# Altium schematic sheet MotherBoard.SchDoc: MFC Mother Board
size B; Address1: aaa; Revision: V0.1
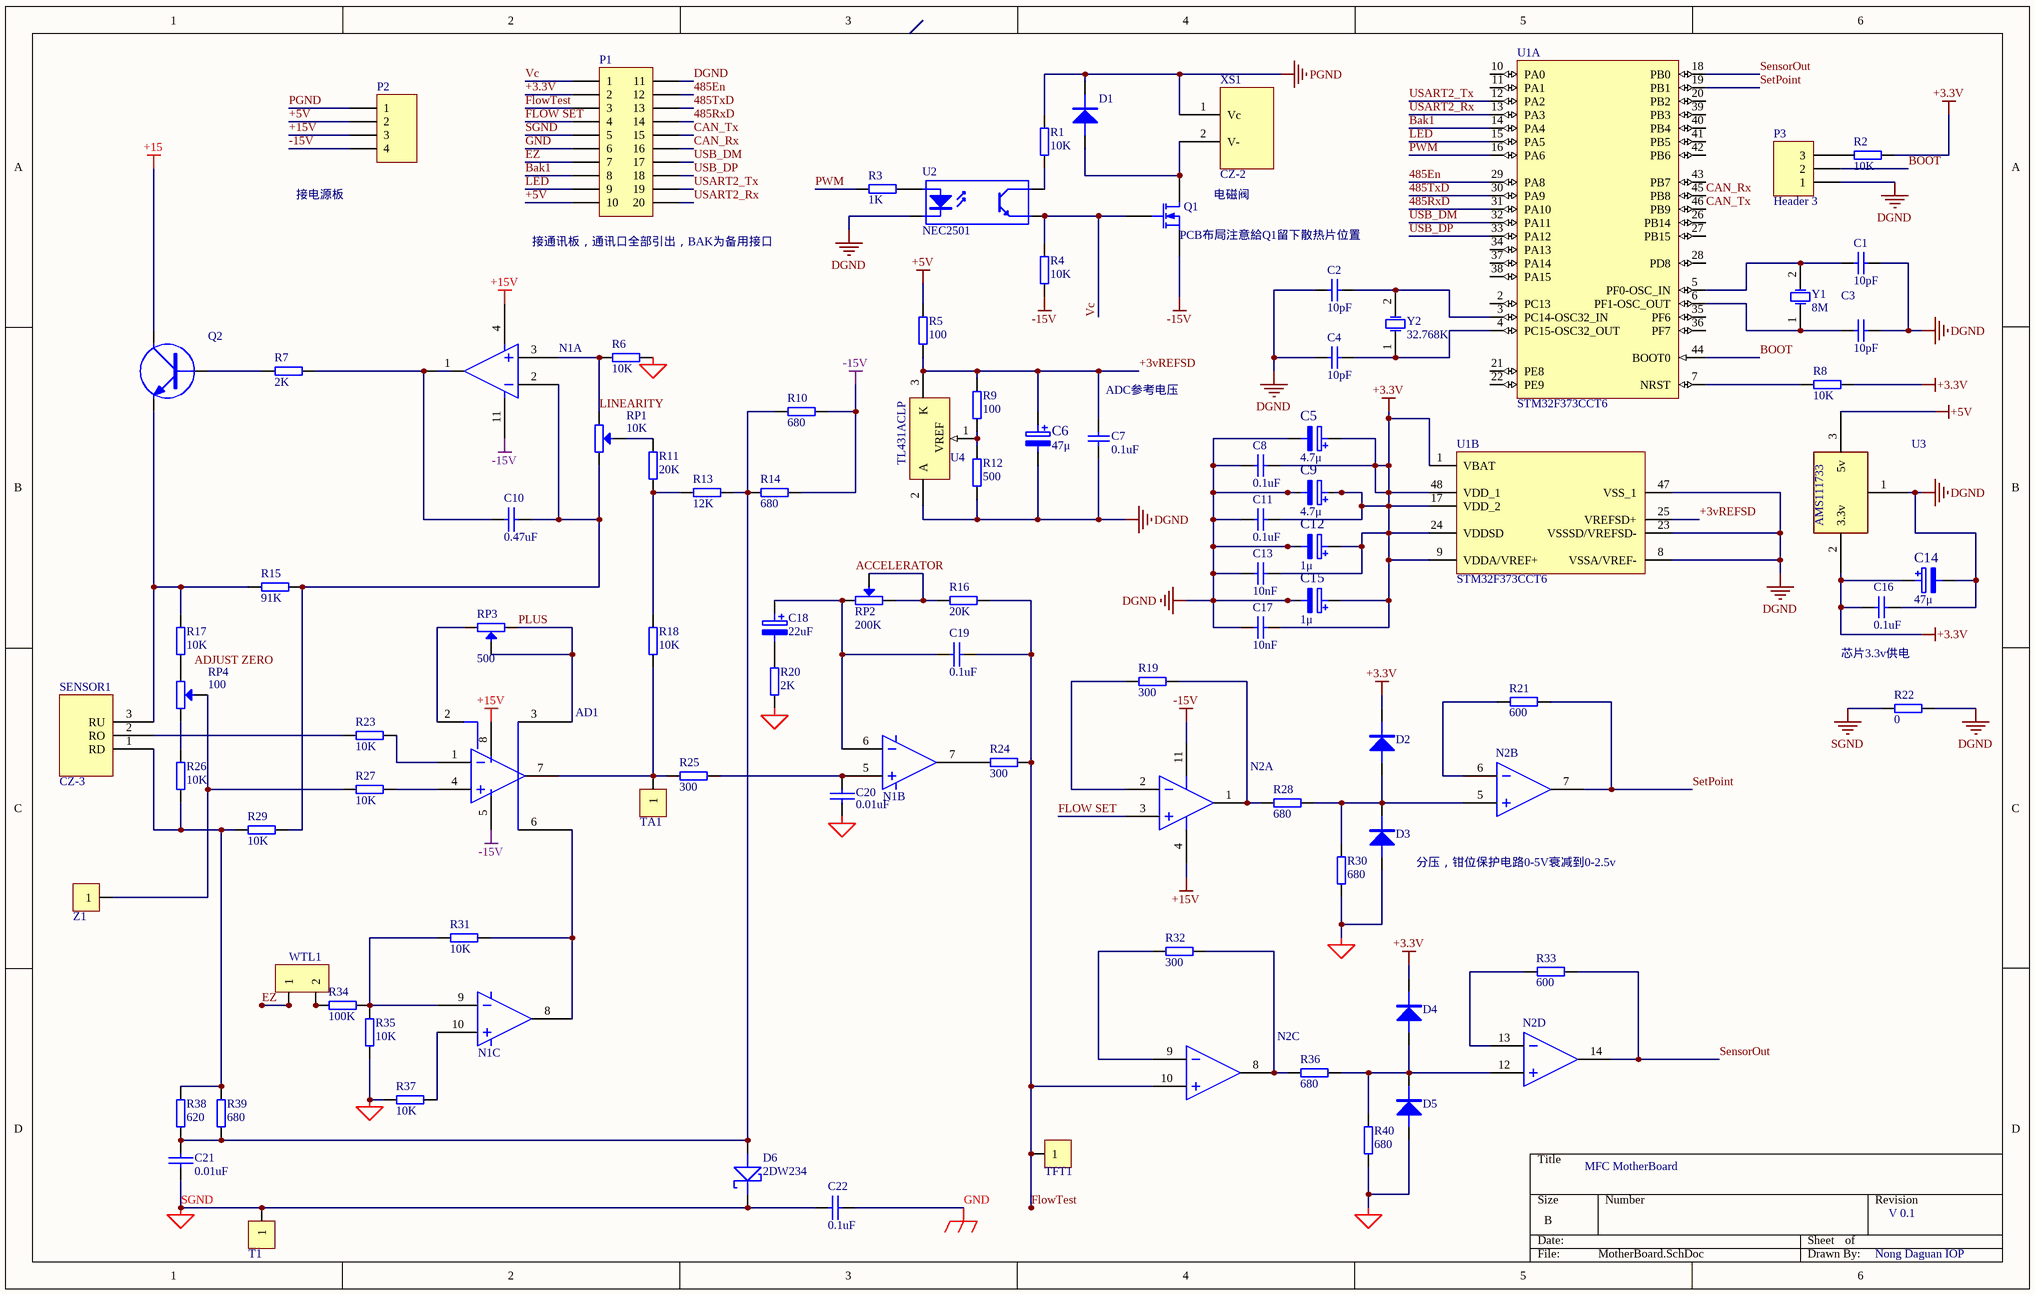
[diagram p0: MotherBoard.SchDoc]

## Parts
AD1  (no value)  [SO-8]
C1  10pF  [R.4]
C2  10pF  [R.4]
C3  10pF  [R.4]
C4  10pF  [R.4]
C5  4.7μ  [CA-22U]
C6  47μ  [CA-22U]
C7  0.1uF  [R.4]
C8  0.1uF  [R.4]
C9  4.7μ  [CA-22U]
C10  0.47uF  [R.4]
C11  0.1uF  [R.4]
C12  1μ  [CA-22U]
C13  10nF  [R.4]
C14  47μ  [CA-22U]
C15  1μ  [CA-22U]
C16  0.1uF  [R.4]
C17  10nF  [R.4]
C18  22uF  [CA-22U]
C19  0.1uF  [R.4]
C20  0.01uF  [R.4]
C21  0.01uF  [R.4]
C22  0.1uF  [R.4]
D1  2CK73C  [V.4]  (value not drawn)
D2  2CK73C  [DIODE]  (value not drawn)
D3  2CK73C  [DIODE]  (value not drawn)
D4  2CK73C  [DIODE]  (value not drawn)
D5  2CK73C  [DIODE]  (value not drawn)
D6  2DW234  [zena]
N1  LM124  [SO-14]  (value not drawn)  (parts A,B,C of 4)
N2  LM124  [SO-14]  (value not drawn)  (parts A,B,C,D of 4)
P1  (no value)  [HDR2X10_CEN]
P2  (no value)  [HDR1X4]
P3  Header 3  [HDR1X3]
Q1  MOSFET-N  [TO-220AB]  (value not drawn)
Q2  MC9013  [BJT]  (value not drawn)
R1  10K  [R.4]
R2  10K  [R.4]
R3  1K  [R.4]
R4  10K  [R.4]
R5  100  [R.4]
R6  10K  [R.4]
R7  2K  [R.4]
R8  10K  [R.4]
R9  100  [RAD0.1]
R10  680  [R.4]
R11  20K  [R.4]
R12  500  [RAD0.1]
R13  12K  [R.4]
R14  680  [R.4]
R15  91K  [R.4]
R16  20K  [R.4]
R17  10K  [RAD0.1]
R18  10K  [R.4]
R19  300  [R.4]
R20  2K  [R.4]
R21  600  [R.4]
R22  0  [R.4]
R23  10K  [R.4]
R24  300  [R.4]
R25  300  [R.4]
R26  10K  [RAD0.1]
R27  10K  [R.4]
R28  680  [RAD0.1]
R29  10K  [R.4]
R30  680  [RAD0.1]
R31  10K  [R.4]
R32  300  [R.4]
R33  600  [R.4]
R34  100K  [R.4]
R35  10K  [R.4]
R36  680  [RAD0.1]
R37  10K  [R.4]
R38  620  [RAD0.1]
R39  680  [RAD0.1]
R40  680  [RAD0.1]
RP1  10K  [VR5132]
RP2  200K  [changable res]
RP3  500  [VR5132]
RP4  100  [VR5132]
SENSOR1  CZ-3  [SENSOR]
T1  CON1  [PAD - RECT]  (value not drawn)
TA1  CON1  [PAD - RECT]  (value not drawn)
TFT1  CON1  [PAD - RECT]  (value not drawn)
U1  STM32F373CCT6  [STM-LQFP48_N]  (parts A,B of 2)
U2  NEC2501  [DIP-4]
U3  AMS111733  [SOT223_N]
U4  TL431ACLP  [LP03]
WTL1  CON1  [ADJ]  (value not drawn)
XS1  CZ-2  [VALVE]
Y1  8M  [XTAL1]
Y2  32.768K  [XTAL1]
Z1  CON1  [PAD - RECT]  (value not drawn)

## Nets
+3.3V: C5.1 C8.2 C9.1 C11.2 C12.1 C13.2 C14.1 C15.1 C16.1 C17.2 D2.K D4.K P1.2 R2.2 R8.2 U1.1(VBAT) U1.9(VDDA/VREF+) U1.17(VDD_2) U1.24(VDDSD) U1.48(VDD_1) U3.2(3.3v)
+5V: P1.10 P2.2 R5.2 U3.3(5v)
+15: Q2.C
+15V: AD1.8 N1.4 N2.4(V+) P2.3
-15V: AD1.5 N1.11 N2.11(GND) P2.4 Q1.3(S) R4.1 R10.2 R14.2
DGND: C1.2 C2.1 C3.2 C4.1 C5.2 C6.2 C7.1 C8.1 C9.2 C11.1 C12.2 C13.1 C14.2 C15.2 C16.2 C17.1 P1.11 P3.1 R12.1 R22.2 U1.8(VSSA/VREF-) U1.23(VSSSD/VREFSD-) U1.47(VSS_1) U2.2(K) U3.1(GND) U4.2(A)
GND: C22.2 P1.6
PGND: D1.K P2.1 R1.2 XS1.1(Vc)
SGND: C20.1 C21.2 C22.1 D3.A D5.A D6.K(CATHODE) P1.5 R6.2 R20.1 R22.1 R30.1 R35.1 R37.2 R40.1 T1.1
485En: P1.12 U1.29(PA8)
485RxD: P1.14 U1.31(PA10)
485TxD: P1.13 U1.30(PA9)
+3vREFSD: C6.1 C7.2 R5.1 R9.1 U1.25(VREFSD+) U4.3(K)
Bak1: P1.8 U1.14(PA4)
BOOT: P3.2 U1.44(BOOT0)
CAN_Rx: P1.16 U1.45(PB8)
CAN_Tx: P1.15 U1.46(PB9)
EZ: P1.7 WTL1.1
FLOW SET: N2.3(INPUT1+) P1.4
FlowTest: C19.2 N2.10(INPUT3+) P1.3 R16.2 R24.2 TFT1.1
LED: P1.9 U1.15(PA5)
PWM: R3.1 U1.16(PA6)
SensorOut: N2.14(OUTPUT4) R33.2 U1.18(PB0)
SetPoint: N2.7(OUTPUT2) R21.2 U1.19(PB1)
USART2_Rx: P1.20 U1.13(PA3)
USART2_Tx: P1.19 U1.12(PA2)
USB_DM: P1.17 U1.32(PA11)
USB_DP: P1.18 U1.33(PA12)
Vc: P1.1 Q1.1(G) R4.2 U2.3(E)
NetAD1_1: AD1.1 R23.2
NetAD1_2: AD1.2 RP3.2
NetAD1_3: AD1.3 RP3.1 RP3.3
NetAD1_4: AD1.4 R27.2
NetAD1_6: AD1.6 N1.8 R31.2
NetAD1_7: AD1.7 R18.1 R25.1 TA1.1
NetC1_1: C1.1 U1.5(PF0-OSC_IN) Y1.2(OSC2)
NetC2_2: C2.2 U1.3(PC14-OSC32_IN) Y2.2(OSC2)
NetC3_1: C3.1 U1.6(PF1-OSC_OUT) Y1.1(OSC1)
NetC4_2: C4.2 U1.4(PC15-OSC32_OUT) Y2.1(OSC1)
NetC10_1: C10.1 N1.1 R7.2
NetC10_2: C10.2 N1.2 R15.2 R29.2 RP1.2
NetC18_1: C18.1 C19.1 N1.6 RP2.1
NetC18_2: C18.2 R20.2
NetC20_2: C20.2 N1.5 R25.2
NetC21_1: C21.1 D6.A(ANODE) R10.1 R13.2 R14.1 R38.1 R39.1
NetD1_A: D1.A Q1.2(D) XS1.2(V-)
NetD2_A: D2.A D3.K N2.5(INTPUT2+) R28.1 R30.2
NetD4_A: D4.A D5.K N2.12(INPUT4+) R36.1 R40.2
NetN1_3: N1.3 R6.1 RP1.1
NetN1_7: N1.7 R24.1
NetN1_9: N1.9 R31.1 R34.2 R35.2
NetN1_10: N1.10 R37.1
NetN2_1: N2.1(OUTPUT1) R19.2 R28.2
NetN2_2: N2.2(INPUT1-) R19.1
NetN2_6: N2.6(INPUT2-) R21.1
NetN2_8: N2.8(OUTPUT3) R32.2 R36.2
NetN2_9: N2.9(INPUT3-) R32.1
NetN2_13: N2.13(INPUT4-) R33.1
NetP3_3: P3.3 R2.1
NetQ2_B: Q2.B R7.1
NetQ2_E: Q2.E R15.1 R17.2 SENSOR1.3(RU)
NetR1_1: R1.1 U2.4(C)
NetR3_2: R3.2 U2.1(A)
NetR8_1: R8.1 U1.7(NRST)
NetR9_2: R9.2 R12.2 U4.1(VREF)
NetR11_1: R11.1 R13.1 R18.2
NetR11_2: R11.2 RP1.3
NetR16_1: R16.1 RP2.2 RP2.3
NetR17_1: R17.1 RP4.1
NetR23_1: R23.1 SENSOR1.2(RO)
NetR26_1: R26.1 R29.1 R38.2 R39.2 SENSOR1.1(RD)
NetR26_2: R26.2 RP4.2
NetR27_1: R27.1 RP4.3 Z1.1
NetR34_1: R34.1 WTL1.2

Not connected (* = marked no-connect by the designer): U1 2(PC13) 10(PA0) 11(PA1) 20(PB2) 21(PE8) 22(PE9) 26(PB14) 27(PB15) 28(PD8) 34(PA13) 35(PF6) 36(PF7) 37(PA14) 38(PA15) 39(PB3) 40(PB4) 41(PB5) 42(PB6) 43(PB7); U3 4

## Notes on the sheet
- 接电源板
- (near Q1) PCB布局注意給Q1留下散热片位置
- 电磁阀
- (near P1) 接通讯板，通讯口全部引出，BAK为备用接口
- (near RP1) LINEARITY
- (near C7) ADC参考电压
- (near RP2) ACCELERATOR
- (near RP3) PLUS
- ADJUST ZERO
- 芯片3.3v供电
- 分压，钳位保护电路0-5V衰减到0-2.5v
- MFC MotherBoard
- V 0.1
- Nong Daguan IOP

## Library data of the parts
AD1 = AD8221
C1 C3 = Cap: Capacitor; Value: 104; Published: 8-Jun-2000; LatestRevisionDate: 17-Jul-2002; LatestRevisionNote: Re-released for DXP Platform.; Publisher: Altium Limited
C2 C4 = CAP: Capacitor; Value: 10; Published: 8-Jun-2000; LatestRevisionDate: 17-Jul-2002; LatestRevisionNote: Re-released for DXP Platform.; Publisher: Altium Limited
C5 C6 C9 C12 C14 C15 C18 = ELECTRO2
C7 C8 C11 C13 C16 C17 = CAP: Capacitor; Value: 104; Published: 8-Jun-2000; LatestRevisionDate: 17-Jul-2002; LatestRevisionNote: Re-released for DXP Platform.; Publisher: Altium Limited
C10 C19-C22 = CAP
D1-D5 = DIODE
D6 = DIODE SCHOTTKY
N1 = MFC7A.S01_LM124_56
N2 = LM1241
P1 = Header 10X2A: Header, 10-Pin, Dual row; LatestRevisionDate: 17-Jul-2002; LatestRevisionNote: Re-released for DXP Platform.; Publisher: Altium Limited
P2 = Header 4: Header, 4-Pin; LatestRevisionDate: 17-Jul-2002; LatestRevisionNote: Re-released for DXP Platform.; Publisher: Altium Limited
P3 = Header 3: Header, 3-Pin; LatestRevisionDate: 17-Jul-2002; LatestRevisionNote: Re-released for DXP Platform.; Publisher: Altium Limited
Q1 = MOSFET-N: N-Channel MOSFET; Published: 8-Jun-2000; LatestRevisionDate: 17-Jul-2002; LatestRevisionNote: Re-released for DXP Platform.; PackageVersion: 1995/1996; PackageReference: E3; Publisher: Altium Limited; PackageDescription: TO, Flat Index; 3 In-Line, Axial Leads; Body Dia. 4.6mm; Lead Dia. 0.5 mm (max)
R1-R8 R10 R11 R13-R16 R18-R25 R27 R29 R31-R35 R37 = RES_1
R9 R12 R17 R26 R28 R30 R36 R38-R40 = RES
RP1 RP3 RP4 = POT2
RP2 = POT2: 3362
U1 = STM32F373CCT6: ARM Cortex-M4 32-bit MCU, 256 KB Flash, 32 KB Internal RAM, 36 I/Os, 48-pin LQFP, -40 to 85 degC, Tray; FLASH Size (Prog) (kB): 256; I/Os (High Current): 36; Internal RAM Size (kB): 32; Operating Frequency(F) (Processor speed) (MHz): 72; Supply Voltage(Vcc) min (V): 2; DatasheetVersion: Rev. 3; PackageVersion: Rev. 6, 06/2013; PackageReference: LQFP48; PackageDescription: 48-Pin Low Profile Quad Flat Package, 7 x 7 mm Body, 0.5 mm Pitch; Supplier 1: Digi-Key; Supplier Part Number 1: 497-13251-ND; Supplier 2: Farnell; Supplier Part Number 2: 2215117; Supplier 3: Newark; Supplier Part Number 3: 46W2195; Supplier 4: Newark; Supplier Part Number 4: 48W6893; Supplier 5: Mouser; Supplier Part Number 5: 511-STM32F373CCT6; Core: ARM Cortex-M4; Packing: Tray; Mounting Technology: Surface Mount; PartNumber: STM32F373CCT6; ComponentLink1Description: Manufacturer URL; ComponentLink1URL: http://www.st.com/web/en/home.html; ComponentLink2Description: Datasheet; ComponentLink2URL: http://www.st.com/st-web-ui/static/active/en/resource/technical/document/datasheet/DM00046749.pdf; ComponentLink3Description: Package Specification; ComponentLink3URL: http://www.st.com/st-web-ui/static/active/en/resource/technical/document/datasheet/DM00058181.pdf
U2 = Optoisolator1: 4-Pin Phototransistor Optocoupler; Published: 24-Mar-1999; LatestRevisionDate: 04-Mar-2005; LatestRevisionNote: Sch pins 3 & 4 Swapped.; DatasheetVersion: Nov-2003; PackageReference: DIP-4; Publisher: Altium Limited
U3 = TL431
U4 = TL431ACLP: Adjustable Precision Shunt Regulator; Published: 15-Apr-2002; LatestRevisionDate: 06-Jun-2005; LatestRevisionNote: Sch pins 1 & 3 swapped; DatasheetVersion: Oct-2000; PackageVersion: Nov-2001; PackageReference: LP03; Publisher: Altium Limited; PackageDescription: TO, Flat Index; 3 In-Line, Axial Leads; Body Dia. 4.8mm; Leads 0.56 x 0.41 mm (max); Code_JEDEC: TO-226-AA; ComponentLink1Description: Manufacturer Link; ComponentLink1URL: http://www.ti.com/; ComponentLink2Description: Datasheet; ComponentLink2URL: http://www-s.ti.com/sc/ds/tl431a.pdf
WTL1 = CON1_1
Y1 Y2 = XTAL: Crystal Oscillator; Published: 8-Jun-2000; LatestRevisionDate: 17-Jul-2002; LatestRevisionNote: Re-released for DXP Platform.; Publisher: Altium Limited